# EAGLE design 1B)dual supply (EAGLE 9.6.2)
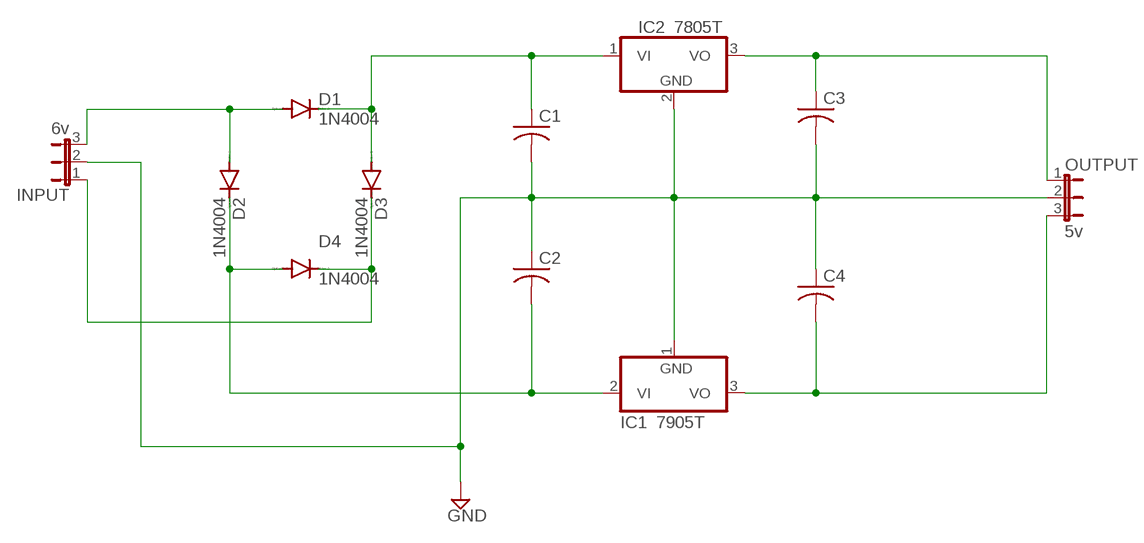
[diagram p0: schematic, sheet 1]

## Parts
C1  C-US150-054X183  [C150-054X183]
C2  C-US150-054X183  [C150-054X183]
C3  C-US150-054X183  [C150-054X183]
C4  C-US150-054X183  [C150-054X183]
D1  1N4004  [DO41-10]
D2  1N4004  [DO41-10]
D3  1N4004  [DO41-10]
D4  1N4004  [DO41-10]
IC1  7905T  7908T  [TO220H]
IC2  7805T  [TO220H]
INPUT  6v  JP2E  [JP2]
OUTPUT  5v  JP2E  [JP2]

## Nets
GND: C1.2 C2.1 C3.2 C4.1 IC1.1(GND) IC2.2(GND) INPUT.2 OUTPUT.2
N$1: D1.A D2.A INPUT.3
N$2: C2.2 D2.C D4.A IC1.2(VI)
N$3: D3.C D4.C INPUT.1
N$4: C1.1 D1.C D3.A IC2.1(VI)
N$9: C4.2 IC1.3(VO) OUTPUT.3
N$11: C3.1 IC2.3(VO) OUTPUT.1

## Library data of the parts
C1-C4 = rcl:C-US: CAPACITOR, American symbol; SPICEPREFIX: C
D1-D4 = diode:1N4004: DIODE general purpose rectifier, 1 A
IC1 = linear:79*: Negative VOLTAGE REGULATOR
IC2 = linear:78*: Positive VOLTAGE REGULATOR Source: http://cache.national.com/ds/LM/LM78L05.pdf http://www.fairchildsemi.com/ds/LM/LM7805.pdf
INPUT OUTPUT = jumper:JP2E: JUMPER

## Board
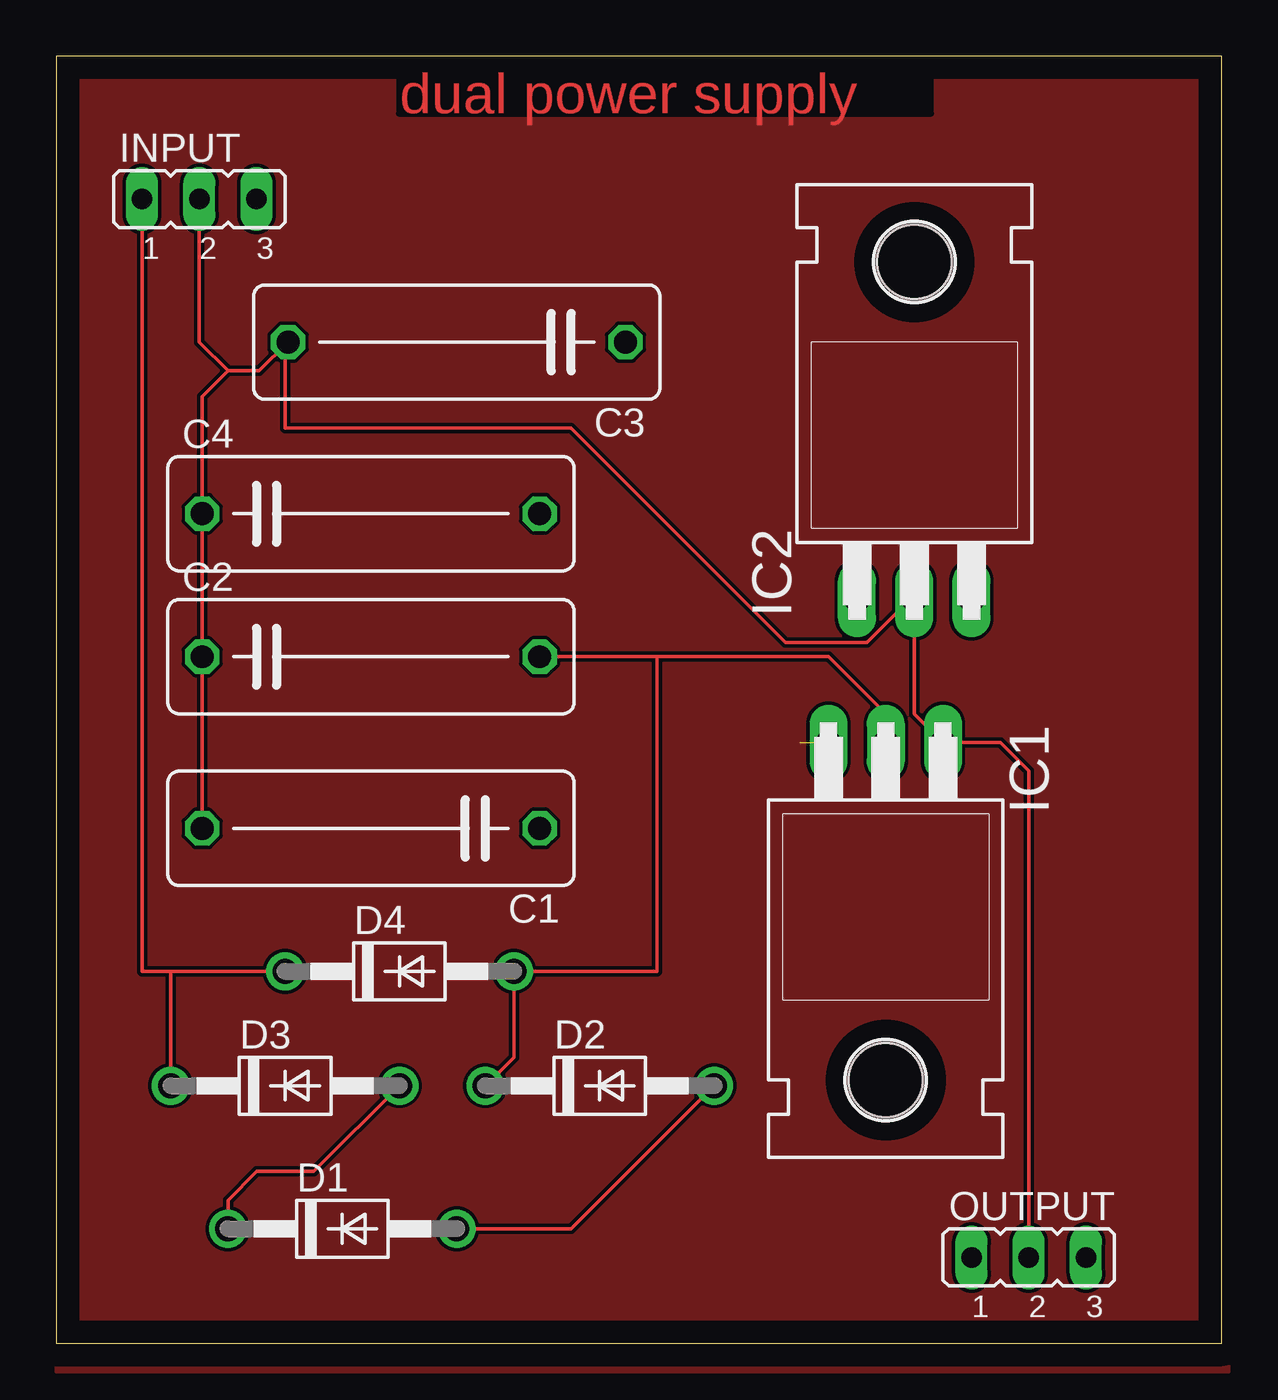
[diagram p1: board, top side]
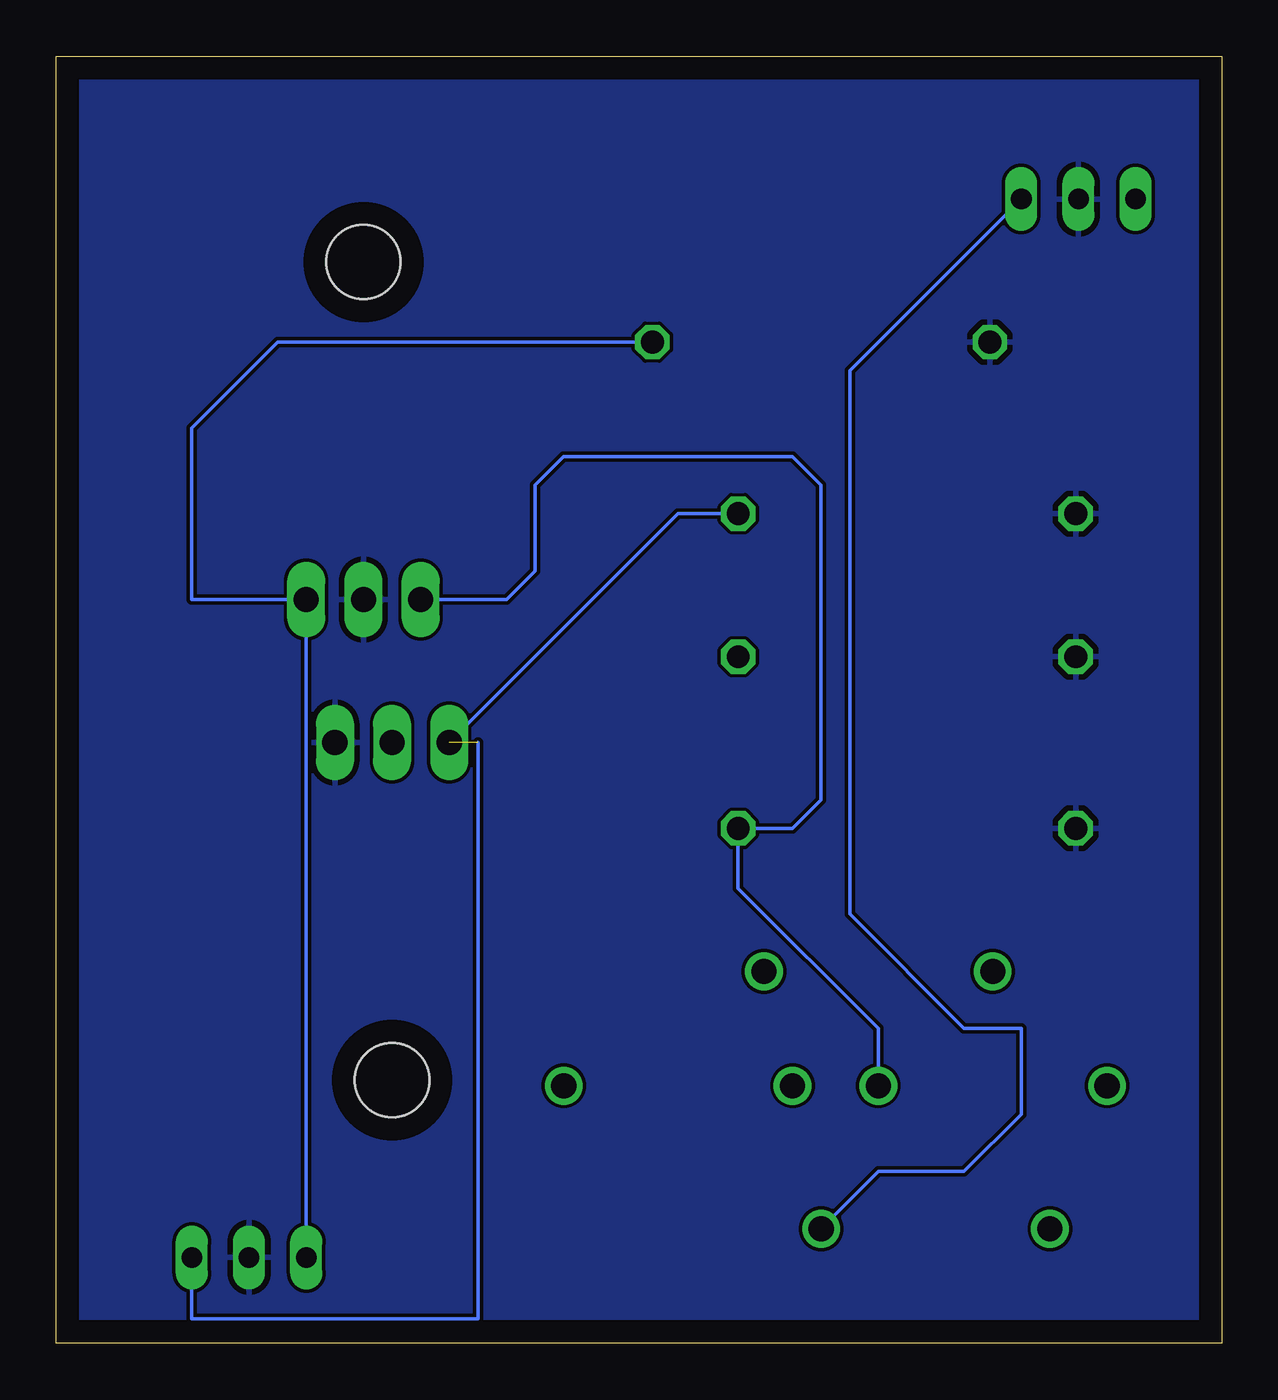
[diagram p2: board, bottom side, seen from below]

Size 51.74 x 57.14 mm. Coordinates in mm from the lower left corner, seen from the top.
Outline: 0,0 51.74,0 51.74,57.14 0,57.14 0,0
Copper layers (1*16): Top 0.035mm / dielectric 1.5mm / Bottom 0.035mm
Design rules "default": minimum track width 6mil, minimum drill 0.35mm, track to track 6mil, track to pad 6mil, pad to pad 6mil, via to via 6mil, smd to smd 6mil, copper to edge 40mil, drill to drill 6mil, minimum pad ring 10mil, minimum via ring 8mil, stop-mask expansion 4mil, vias tented up to drill 0mil, thermal gap 10mil

### Footprints (pad centres in the part's own frame; a part is rotated, then mirrored left to right if it is on the bottom)
C150-054X183 = drill 1.016 octagon: 1 -7.493,0; 2 7.493,0
DO41-10 = drill 1.118: A 5.08,0; C -5.08,0
TO220H = drill 1.118 long: 1 -2.54,-10.16; 2 0,-10.16; 3 2.54,-10.16 | hole 3.302: 0,4.826
JP2 = drill 0.914 long: 1 -2.54,0; 2 0,0; 3 2.54,0

### Placement (x,y rotation side)
C1  13.97,22.86 180 top
C2  13.97,30.48 0 top
C3  17.78,44.45 180 top
C4  13.97,36.83 0 top
D1  12.7,5.08 0 top
D2  24.13,11.43 0 top
D3  10.16,11.43 0 top
D4  15.24,16.51 0 top
IC1  36.83,16.51 180 top
IC2  38.1,43.18 0 top
INPUT  6.35,50.8 0 top
OUTPUT  43.18,3.81 0 top

### Tracks (layer width: path | path; a pad name or v marks a point on that pad's centre or on a via)
GND
  Top 0.152: C1.2 C2.1 C4.1 6.48,42.04 7.62,43.18 | OUTPUT.2 43.18,25.4 41.91,26.67 IC1.1 38.1,27.94 IC2.2 37.91,33.02 36,31.11 32.38,31.11 22.86,40.64 10.16,40.64 10.16,44.32 C3.2 9.02,43.18 7.62,43.18 | INPUT.2 6.35,44.45 7.62,43.18
  pour Bottom: 0,57.15 50.8,57.15 52.07,55.88 52.07,-1.27 -1.27,-1.27 -1.27,55.88
N$1
  Top 0.152: D2.A 22.86,5.08 D1.A
  Bottom 0.152: INPUT.3 16.51,43.18 16.51,19.05 11.43,13.97 8.89,13.97 8.89,10.16 11.43,7.62 15.24,7.62 D1.A
N$2
  Top 0.152: IC1.2 36.83,27.94 34.29,30.48 C2.2 26.67,30.48 26.67,16.51 D4.A 20.32,12.7 D2.C
N$3
  Top 0.152: D4.C 5.08,16.51 | 5.08,16.51 D3.C | INPUT.1 3.81,16.51 5.08,16.51
N$4
  Top 0.152: D3.A 11.43,7.62 8.89,7.62 7.62,6.35 D1.C
  Bottom 0.152: D3.A 15.24,13.97 21.46,20.19 C1.1 19.05,22.86 17.78,24.13 17.78,38.1 19.05,39.37 29.21,39.37 30.48,38.1 30.48,34.29 31.75,33.02 IC2.1
N$9  (1 unrouted)
  Bottom 0.152: OUTPUT.3 45.72,1.09 33.02,1.09 33.02,26.67 | IC1.3 24.13,36.83 C4.2
N$11
  Bottom 0.152: C3.1 41.91,44.45 45.72,40.64 45.72,33.02 IC2.3 40.64,31.75 40.64,30.48 OUTPUT.1
VCC
  pour Top: 0,57.15 52.07,57.15 52.07,-1.27 0,-1.27

### Text on the board
Top: dual power supply